# Altium schematic sheet 01 - NEW.SchDoc
size 513 x 386 mm
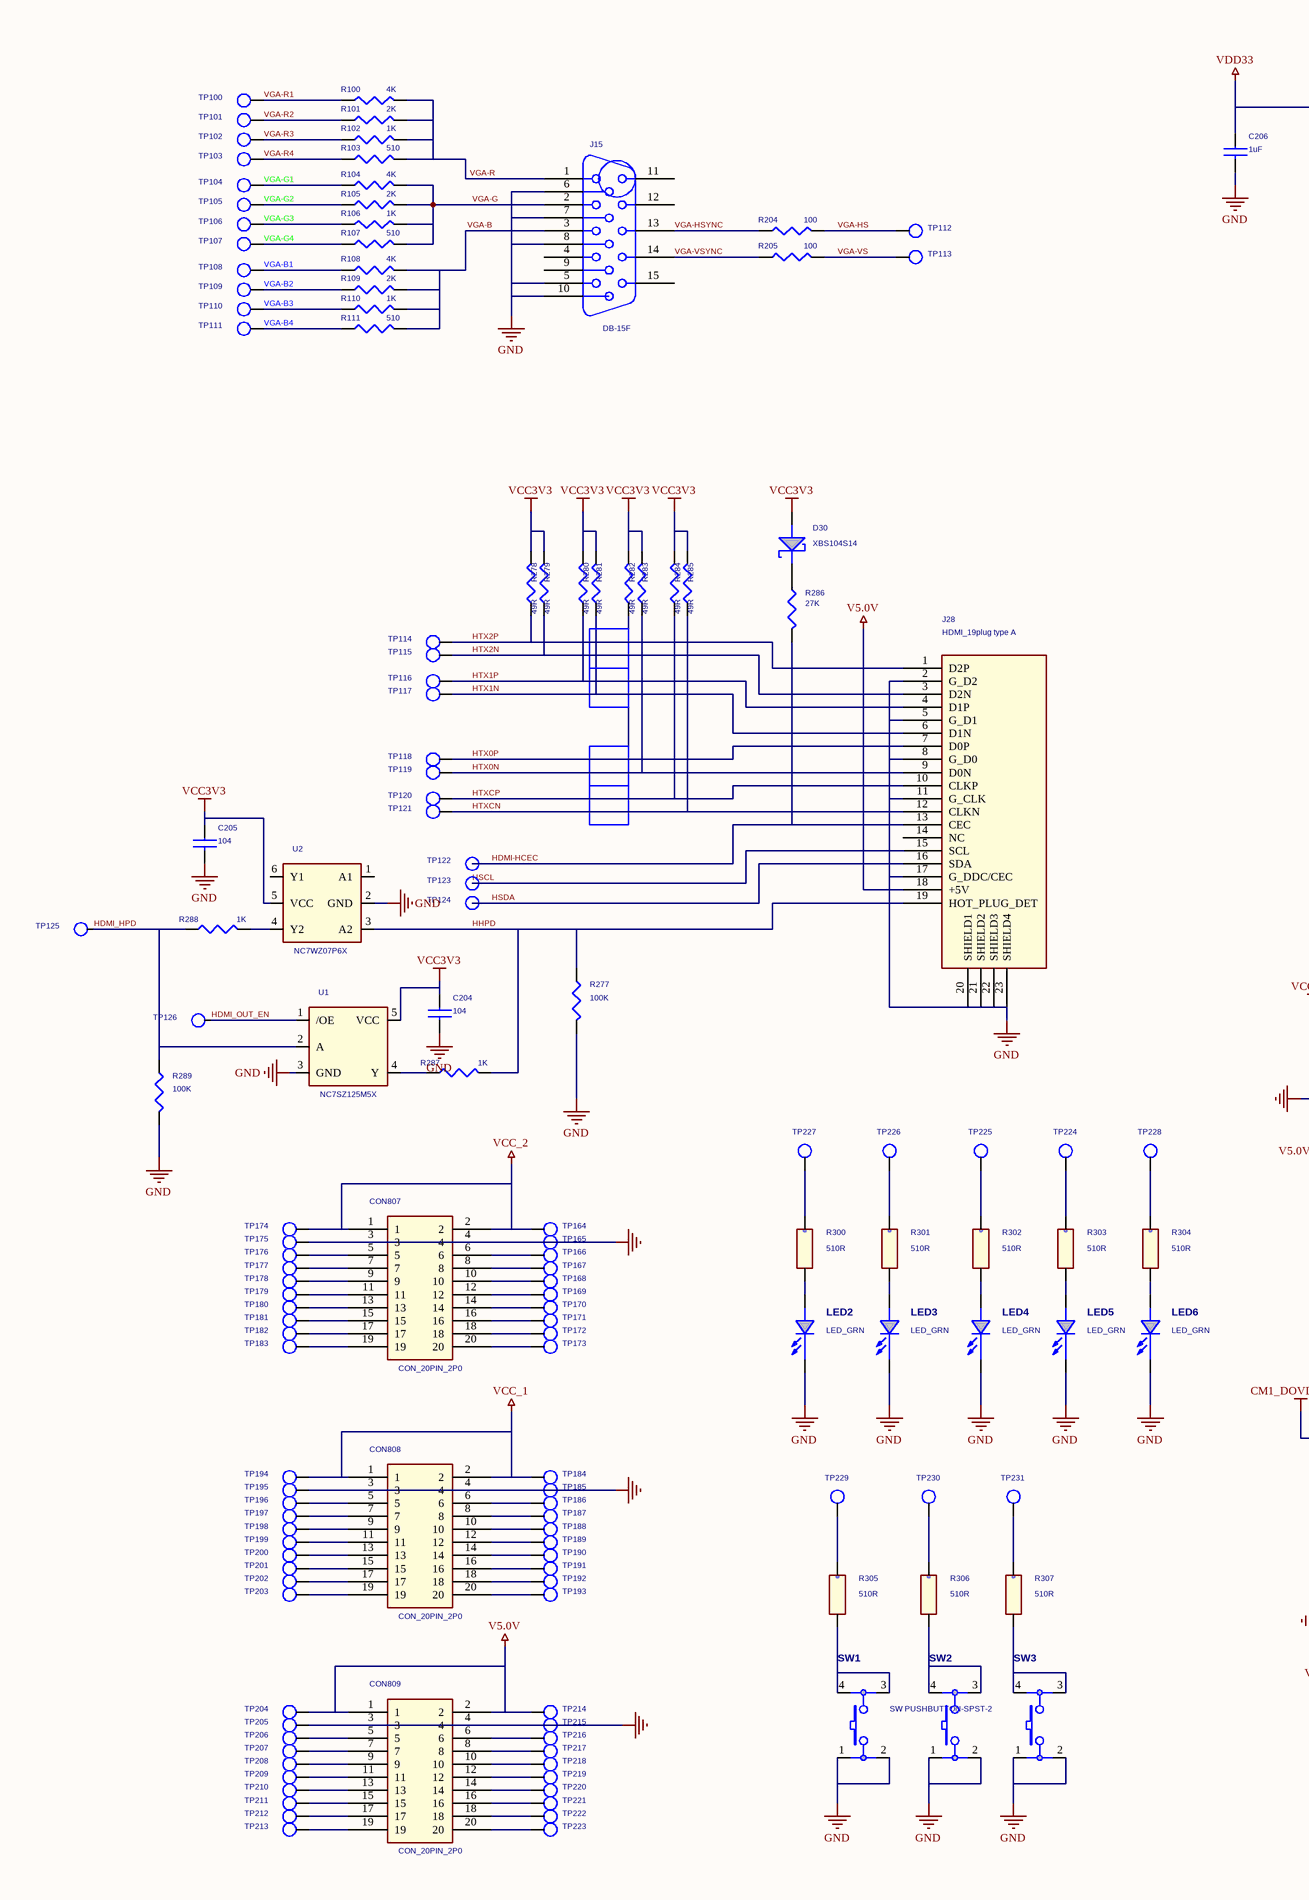
[diagram p0: 01 - NEW.SchDoc, left]
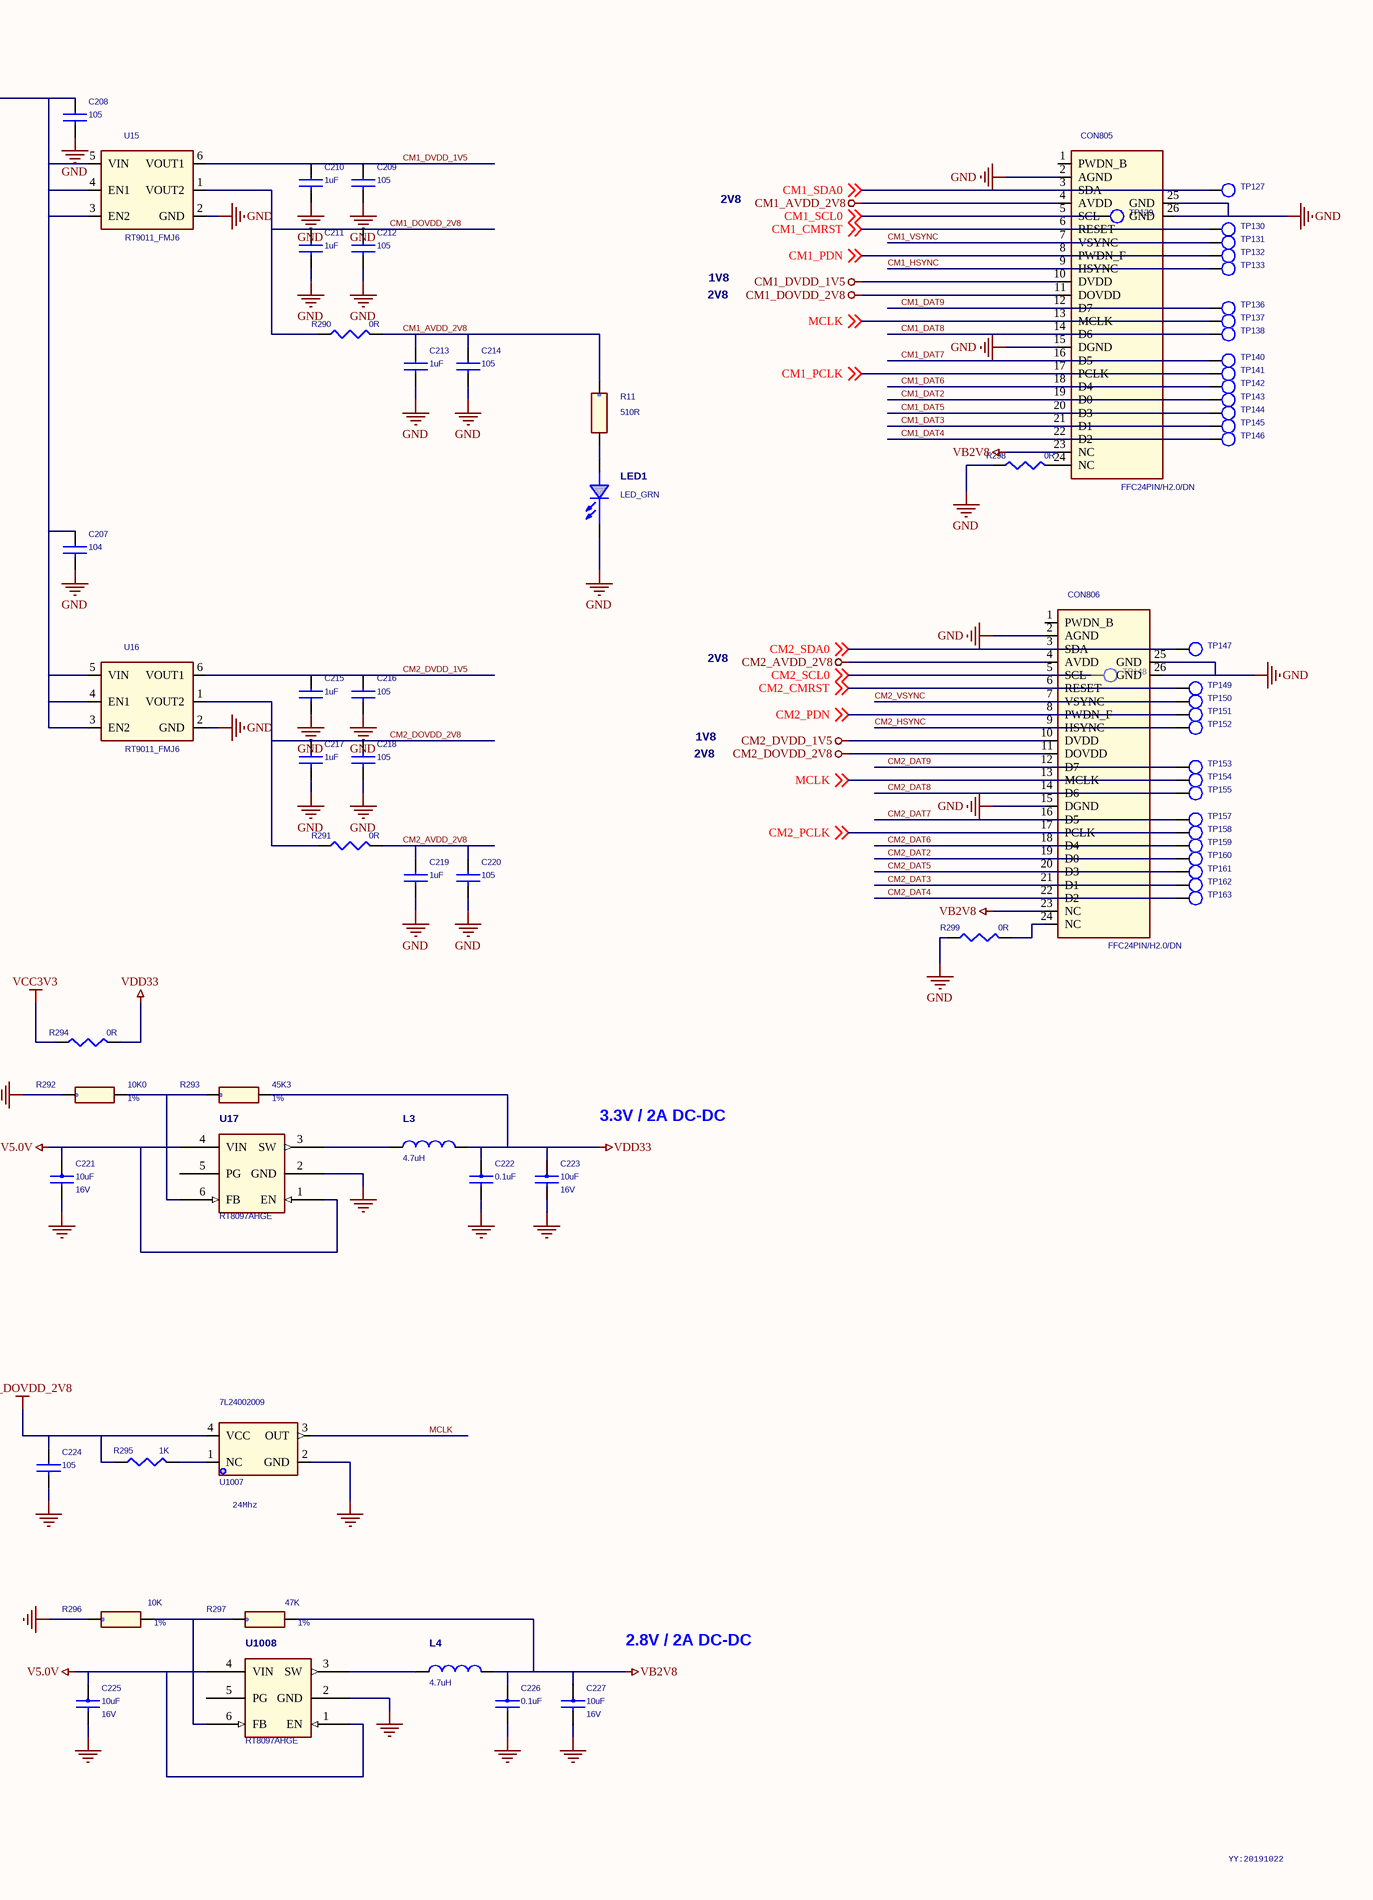
[diagram p1: 01 - NEW.SchDoc, right]

## Parts
C204  104  [C0603]
C205  104  [C0603]
C206  1uF  [C0603]
C207  104  [C0603]
C208  105  [C0603]
C209  105  [C0603]
C210  1uF  [C0603]
C211  1uF  [C0603]
C212  105  [C0603]
C213  1uF  [C0603]
C214  105  [C0603]
C215  1uF  [C0603]
C216  105  [C0603]
C217  1uF  [C0603]
C218  105  [C0603]
C219  1uF  [C0603]
C220  105  [C0603]
C221  10uF  Voltage: 16V  [CAP0603]
C222  0.1uF  [CAP0402]
C223  10uF  Voltage: 16V  [CAP0603]
C224  105  [C0603]
C225  10uF  Voltage: 16V  [CAP0603]
C226  0.1uF  [CAP0402]
C227  10uF  Voltage: 16V  [CAP0603]
CON805  FFC24PIN/H2.0/DN  [Molex52745-2090/P0.5]
CON806  FFC24PIN/H2.0/DN  [Molex52745-2090/P0.5]
CON807  CON_20PIN_2P0  [CON_20PIN_2P0]
CON808  CON_20PIN_2P0  [CON_20PIN_2P0]
CON809  CON_20PIN_2P0  [CON_20PIN_2P0]
D30  XBS104S14  [SOD123]
J15  DB-15F  [DB-9F]
J28  HDMI_19plug type A  [HDMI]
L3  4.7uH  [IND2520]
L4  4.7uH  [IND2520]
LED1  LED_GRN  [LED0402]
LED2  LED_GRN  [LED0402]
LED3  LED_GRN  [LED0402]
LED4  LED_GRN  [LED0402]
LED5  LED_GRN  [LED0402]
LED6  LED_GRN  [LED0402]
R11  510R  [RES0402]
R100  4K  [RES0402]
R101  2K  [RES0402]
R102  1K  [RES0402]
R103  510  [RES0402]
R104  4K  [RES0402]
R105  2K  [RES0402]
R106  1K  [RES0402]
R107  510  [RES0402]
R108  4K  [RES0402]
R109  2K  [RES0402]
R110  1K  [RES0402]
R111  510  [RES0402]
R204  100  [RES0402]
R205  100  [RES0402]
R277  100K  [RES0402]
R278  49R  [RES0402]
R279  49R  [RES0402]
R280  49R  [RES0402]
R281  49R  [RES0402]
R282  49R  [RES0402]
R283  49R  [RES0402]
R284  49R  [RES0402]
R285  49R  [RES0402]
R286  27K  [RES0402]
R287  1K  [RES0402]
R288  1K  [RES0402]
R289  100K  [RES0402]
R290  0R  [RES0402]
R291  0R  [RES0402]
R292  10K0  Tolerance: 1%  [RES0402]
R293  45K3  Tolerance: 1%  [RES0402]
R294  0R  [RES0402]
R295  1K  [RES0402]
R296  10K  Tolerance: 1%  [RES0402]
R297  47K  Tolerance: 1%  [RES0402]
R298  0R  [RES0402]
R299  0R  [RES0402]
R300  510R  [RES0402]
R301  510R  [RES0402]
R302  510R  [RES0402]
R303  510R  [RES0402]
R304  510R  [RES0402]
R305  510R  [RES0402]
R306  510R  [RES0402]
R307  510R  [RES0402]
SW1  SW PUSHBUTTON-SPST-2  [SW_TACT_4PIN]
SW2  SW PUSHBUTTON-SPST-2  [SW_TACT_4PIN]  (value not drawn)
SW3  SW PUSHBUTTON-SPST-2  [SW_TACT_4PIN]  (value not drawn)
TP100  T  [T60_40]  (value not drawn)
TP101  T  [T60_40]  (value not drawn)
TP102  T  [T60_40]  (value not drawn)
TP103  T  [T60_40]  (value not drawn)
TP104  T  [T60_40]  (value not drawn)
TP105  T  [T60_40]  (value not drawn)
TP106  T  [T60_40]  (value not drawn)
TP107  T  [T60_40]  (value not drawn)
TP108  T  [T60_40]  (value not drawn)
TP109  T  [T60_40]  (value not drawn)
TP110  T  [T60_40]  (value not drawn)
TP111  T  [T60_40]  (value not drawn)
TP112  T  [T60_40]  (value not drawn)
TP113  T  [T60_40]  (value not drawn)
TP114  T  [T60_40]  (value not drawn)
TP115  T  [T60_40]  (value not drawn)
TP116  T  [T60_40]  (value not drawn)
TP117  T  [T60_40]  (value not drawn)
TP118  T  [T60_40]  (value not drawn)
TP119  T  [T60_40]  (value not drawn)
TP120  T  [T60_40]  (value not drawn)
TP121  T  [T60_40]  (value not drawn)
TP122  T  [T60_40]  (value not drawn)
TP123  T  [T60_40]  (value not drawn)
TP124  T  [T60_40]  (value not drawn)
TP125  T  [T60_40]  (value not drawn)
TP126  T  [T60_40]  (value not drawn)
TP127  T  [T60_40]  (value not drawn)
TP129  T  [T60_40]  (value not drawn)
TP130  T  [T60_40]  (value not drawn)
TP131  T  [T60_40]  (value not drawn)
TP132  T  [T60_40]  (value not drawn)
TP133  T  [T60_40]  (value not drawn)
TP136  T  [T60_40]  (value not drawn)
TP137  T  [T60_40]  (value not drawn)
TP138  T  [T60_40]  (value not drawn)
TP140  T  [T60_40]  (value not drawn)
TP141  T  [T60_40]  (value not drawn)
TP142  T  [T60_40]  (value not drawn)
TP143  T  [T60_40]  (value not drawn)
TP144  T  [T60_40]  (value not drawn)
TP145  T  [T60_40]  (value not drawn)
TP146  T  [T60_40]  (value not drawn)
TP147  T  [T60_40]  (value not drawn)
TP148  T  [T60_40]  (value not drawn)
TP149  T  [T60_40]  (value not drawn)
TP150  T  [T60_40]  (value not drawn)
TP151  T  [T60_40]  (value not drawn)
TP152  T  [T60_40]  (value not drawn)
TP153  T  [T60_40]  (value not drawn)
TP154  T  [T60_40]  (value not drawn)
TP155  T  [T60_40]  (value not drawn)
TP157  T  [T60_40]  (value not drawn)
TP158  T  [T60_40]  (value not drawn)
TP159  T  [T60_40]  (value not drawn)
TP160  T  [T60_40]  (value not drawn)
TP161  T  [T60_40]  (value not drawn)
TP162  T  [T60_40]  (value not drawn)
TP163  T  [T60_40]  (value not drawn)
TP164  T  [T60_40]  (value not drawn)
TP165  T  [T60_40]  (value not drawn)
TP166  T  [T60_40]  (value not drawn)
TP167  T  [T60_40]  (value not drawn)
TP168  T  [T60_40]  (value not drawn)
TP169  T  [T60_40]  (value not drawn)
TP170  T  [T60_40]  (value not drawn)
TP171  T  [T60_40]  (value not drawn)
TP172  T  [T60_40]  (value not drawn)
TP173  T  [T60_40]  (value not drawn)
TP174  T  [T60_40]  (value not drawn)
TP175  T  [T60_40]  (value not drawn)
TP176  T  [T60_40]  (value not drawn)
TP177  T  [T60_40]  (value not drawn)
TP178  T  [T60_40]  (value not drawn)
TP179  T  [T60_40]  (value not drawn)
TP180  T  [T60_40]  (value not drawn)
TP181  T  [T60_40]  (value not drawn)
TP182  T  [T60_40]  (value not drawn)
TP183  T  [T60_40]  (value not drawn)
TP184  T  [T60_40]  (value not drawn)
TP185  T  [T60_40]  (value not drawn)
TP186  T  [T60_40]  (value not drawn)
TP187  T  [T60_40]  (value not drawn)
TP188  T  [T60_40]  (value not drawn)
TP189  T  [T60_40]  (value not drawn)
TP190  T  [T60_40]  (value not drawn)
TP191  T  [T60_40]  (value not drawn)
TP192  T  [T60_40]  (value not drawn)
TP193  T  [T60_40]  (value not drawn)
TP194  T  [T60_40]  (value not drawn)
TP195  T  [T60_40]  (value not drawn)
TP196  T  [T60_40]  (value not drawn)
TP197  T  [T60_40]  (value not drawn)
TP198  T  [T60_40]  (value not drawn)
TP199  T  [T60_40]  (value not drawn)
TP200  T  [T60_40]  (value not drawn)
TP201  T  [T60_40]  (value not drawn)
TP202  T  [T60_40]  (value not drawn)
TP203  T  [T60_40]  (value not drawn)
TP204  T  [T60_40]  (value not drawn)
TP205  T  [T60_40]  (value not drawn)
TP206  T  [T60_40]  (value not drawn)
TP207  T  [T60_40]  (value not drawn)
TP208  T  [T60_40]  (value not drawn)
TP209  T  [T60_40]  (value not drawn)
TP210  T  [T60_40]  (value not drawn)
TP211  T  [T60_40]  (value not drawn)
TP212  T  [T60_40]  (value not drawn)
TP213  T  [T60_40]  (value not drawn)
TP214  T  [T60_40]  (value not drawn)
TP215  T  [T60_40]  (value not drawn)
TP216  T  [T60_40]  (value not drawn)
TP217  T  [T60_40]  (value not drawn)
TP218  T  [T60_40]  (value not drawn)
TP219  T  [T60_40]  (value not drawn)
TP220  T  [T60_40]  (value not drawn)
TP221  T  [T60_40]  (value not drawn)
TP222  T  [T60_40]  (value not drawn)
TP223  T  [T60_40]  (value not drawn)
TP224  T  [T60_40]  (value not drawn)
TP225  T  [T60_40]  (value not drawn)
TP226  T  [T60_40]  (value not drawn)
TP227  T  [T60_40]  (value not drawn)
TP228  T  [T60_40]  (value not drawn)
TP229  T  [T60_40]  (value not drawn)
TP230  T  [T60_40]  (value not drawn)
TP231  T  [T60_40]  (value not drawn)
U1  NC7SZ125M5X  [NC7SZ125M5X]
U2  NC7WZ07P6X  [NC7WZ07P6X]
U15  RT9011_FMJ6  [RT9011_FMJ6]
U16  RT9011_FMJ6  [RT9011_FMJ6]
U17  RT8097AHGE  [SOT23-5]
U1007  7L24002009  [OSC/SMD/D1.3X2.1]
U1008  RT8097AHGE  [SOT23-5]

## Nets
CM1_AVDD_2V8: C213.1 C214.1 CON805.4(AVDD) R11.1 R290.2
CM1_DOVDD_2V8: C211.1 C212.1 C224.1 CON805.11(DOVDD) R290.1 R295.1 U15.1(VOUT2) U1007.4(VCC)
CM1_DVDD_1V5: C209.1 C210.1 CON805.10(DVDD) U15.6(VOUT1)
CM2_AVDD_2V8: C219.1 C220.1 CON806.4(AVDD) R291.2
CM2_DOVDD_2V8: C217.1 C218.1 CON806.11(DOVDD) R291.1 U16.1(VOUT2)
CM2_DVDD_1V5: C215.1 C216.1 CON806.10(DVDD) U16.6(VOUT1)
GND: C204.2 C205.2 C206.2 C207.2 C208.2 C209.2 C210.2 C211.2 C212.2 C213.2 C214.2 C215.2 C216.2 C217.2 C218.2 C219.2 C220.2 C221.2 C222.2 C223.2 C224.2 C225.2 C226.2 C227.2 CON805.2(AGND) CON805.15(DGND) CON805.25(GND) CON805.26(GND) CON806.2(AGND) CON806.15(DGND) CON806.25(GND) CON806.26(GND) CON807.3 CON807.4 CON808.3 CON808.4 CON809.3 CON809.4 J15.5 J15.6 J15.7 J15.8 J15.10 J28.2(G_D2) J28.5(G_D1) J28.8(G_D0) J28.11(G_CLK) J28.17(G_DDC/CEC) J28.20(SHIELD1) J28.21(SHIELD2) J28.22(SHIELD3) J28.23(SHIELD4) LED1.2(CATHODE) LED2.2(CATHODE) LED3.2(CATHODE) LED4.2(CATHODE) LED5.2(CATHODE) LED6.2(CATHODE) R277.2 R289.2 R292.1 R296.1 R298.1 R299.1 SW1.1 SW1.2 SW2.1 SW2.2 SW3.1 SW3.2 TP165.1(TP) TP175.1(TP) TP185.1(TP) TP195.1(TP) TP205.1(TP) TP215.1(TP) U1.3(GND) U2.2(GND) U15.2(GND) U16.2(GND) U17.2(GND) U1007.2(GND) U1008.2(GND)
V5.0V: C221.1 C225.1 CON809.1 CON809.2 J28.18(+5V) TP204.1(TP) TP214.1(TP) U17.1(EN) U17.4(VIN) U1008.1(EN) U1008.4(VIN)
VB2V8: C226.1 C227.1 CON805.23(NC) CON806.23(NC) L4.2 R297.2
VCC3V3: C204.1 C205.1 D30.1(A) R278.2 R279.2 R280.2 R281.2 R282.2 R283.2 R284.2 R285.2 R294.1 U1.5(VCC) U2.5(VCC)
VCC_1: CON808.1 CON808.2 TP184.1(TP) TP194.1(TP)
VCC_2: CON807.1 CON807.2 TP164.1(TP) TP174.1(TP)
VDD33: C206.1 C207.1 C208.1 C222.1 C223.1 L3.2 R293.2 R294.2 U15.3(EN2) U15.4(EN1) U15.5(VIN) U16.3(EN2) U16.4(EN1) U16.5(VIN)
CM1_CMRST: CON805.6(RESET) TP130.1(TP) ; off-sheet CM1_CMRST
CM1_DAT2: CON805.19(D0) TP143.1(TP)
CM1_DAT3: CON805.21(D1) TP145.1(TP)
CM1_DAT4: CON805.22(D2) TP146.1(TP)
CM1_DAT5: CON805.20(D3) TP144.1(TP)
CM1_DAT6: CON805.18(D4) TP142.1(TP)
CM1_DAT7: CON805.16(D5) TP140.1(TP)
CM1_DAT8: CON805.14(D6) TP138.1(TP)
CM1_DAT9: CON805.12(D7) TP136.1(TP)
CM1_HSYNC: CON805.9(HSYNC) TP133.1(TP)
CM1_PCLK: CON805.17(PCLK) TP141.1(TP) ; off-sheet CM1_PCLK
CM1_PDN: CON805.8(PWDN_F) TP132.1(TP) ; off-sheet CM1_PDN
CM1_SCL0: CON805.5(SCL) TP129.1(TP) ; off-sheet CM1_SCL0
CM1_SDA0: CON805.3(SDA) TP127.1(TP) ; off-sheet CM1_SDA0
CM1_VSYNC: CON805.7(VSYNC) TP131.1(TP)
CM2_CMRST: CON806.6(RESET) TP149.1(TP) ; off-sheet CM2_CMRST
CM2_DAT2: CON806.19(D0) TP160.1(TP)
CM2_DAT3: CON806.21(D1) TP162.1(TP)
CM2_DAT4: CON806.22(D2) TP163.1(TP)
CM2_DAT5: CON806.20(D3) TP161.1(TP)
CM2_DAT6: CON806.18(D4) TP159.1(TP)
CM2_DAT7: CON806.16(D5) TP157.1(TP)
CM2_DAT8: CON806.14(D6) TP155.1(TP)
CM2_DAT9: CON806.12(D7) TP153.1(TP)
CM2_HSYNC: CON806.9(HSYNC) TP152.1(TP)
CM2_PCLK: CON806.17(PCLK) TP158.1(TP) ; off-sheet CM2_PCLK
CM2_PDN: CON806.8(PWDN_F) TP151.1(TP) ; off-sheet CM2_PDN
CM2_SCL0: CON806.5(SCL) TP148.1(TP) ; off-sheet CM2_SCL0
CM2_SDA0: CON806.3(SDA) TP147.1(TP) ; off-sheet CM2_SDA0
CM2_VSYNC: CON806.7(VSYNC) TP150.1(TP)
HDMI-HCEC: J28.13(CEC) R286.1 TP122.1(TP)
HDMI_HPD: R288.1 R289.1 TP125.1(TP) U1.2(A)
HDMI_OUT_EN: TP126.1(TP) U1.1(/OE)
HHPD: J28.19(HOT_PLUG_DET) R277.1 R287.2 U2.3(A2)
HSCL: J28.15(SCL) TP123.1(TP)
HSDA: J28.16(SDA) TP124.1(TP)
HTX0N: J28.9(D0N) R283.1 TP119.1(TP)
HTX0P: J28.7(D0P) R282.1 TP118.1(TP)
HTX1N: J28.6(D1N) R281.1 TP117.1(TP)
HTX1P: J28.4(D1P) R280.1 TP116.1(TP)
HTX2N: J28.3(D2N) R279.1 TP115.1(TP)
HTX2P: J28.1(D2P) R278.1 TP114.1(TP)
HTXCN: J28.12(CLKN) R285.1 TP121.1(TP)
HTXCP: J28.10(CLKP) R284.1 TP120.1(TP)
MCLK: CON805.13(MCLK) CON806.13(MCLK) TP137.1(TP) TP154.1(TP) U1007.3(OUT) ; off-sheet MCLK
VGA-B: J15.3 R108.2 R109.2 R110.2 R111.2
VGA-B1: R108.1 TP108.1(TP)
VGA-B2: R109.1 TP109.1(TP)
VGA-B3: R110.1 TP110.1(TP)
VGA-B4: R111.1 TP111.1(TP)
VGA-G: J15.2 R104.2 R105.2 R106.2 R107.2
VGA-G1: R104.1 TP104.1(TP)
VGA-G2: R105.1 TP105.1(TP)
VGA-G3: R106.1 TP106.1(TP)
VGA-G4: R107.1 TP107.1(TP)
VGA-HS: R204.2 TP112.1(TP)
VGA-HSYNC: J15.13 R204.1
VGA-R: J15.1 R100.2 R101.2 R102.2 R103.2
VGA-R1: R100.1 TP100.1(TP)
VGA-R2: R101.1 TP101.1(TP)
VGA-R3: R102.1 TP102.1(TP)
VGA-R4: R103.1 TP103.1(TP)
VGA-VS: R205.2 TP113.1(TP)
VGA-VSYNC: J15.14 R205.1
NetCON805_24: CON805.24(NC) R298.2
NetCON806_24: CON806.24(NC) R299.2
NetCON807_5: CON807.5 TP176.1(TP)
NetCON807_6: CON807.6 TP166.1(TP)
NetCON807_7: CON807.7 TP177.1(TP)
NetCON807_8: CON807.8 TP167.1(TP)
NetCON807_9: CON807.9 TP178.1(TP)
NetCON807_10: CON807.10 TP168.1(TP)
NetCON807_11: CON807.11 TP179.1(TP)
NetCON807_12: CON807.12 TP169.1(TP)
NetCON807_13: CON807.13 TP180.1(TP)
NetCON807_14: CON807.14 TP170.1(TP)
NetCON807_15: CON807.15 TP181.1(TP)
NetCON807_16: CON807.16 TP171.1(TP)
NetCON807_17: CON807.17 TP182.1(TP)
NetCON807_18: CON807.18 TP172.1(TP)
NetCON807_19: CON807.19 TP183.1(TP)
NetCON807_20: CON807.20 TP173.1(TP)
NetCON808_5: CON808.5 TP196.1(TP)
NetCON808_6: CON808.6 TP186.1(TP)
NetCON808_7: CON808.7 TP197.1(TP)
NetCON808_8: CON808.8 TP187.1(TP)
NetCON808_9: CON808.9 TP198.1(TP)
NetCON808_10: CON808.10 TP188.1(TP)
NetCON808_11: CON808.11 TP199.1(TP)
NetCON808_12: CON808.12 TP189.1(TP)
NetCON808_13: CON808.13 TP200.1(TP)
NetCON808_14: CON808.14 TP190.1(TP)
NetCON808_15: CON808.15 TP201.1(TP)
NetCON808_16: CON808.16 TP191.1(TP)
NetCON808_17: CON808.17 TP202.1(TP)
NetCON808_18: CON808.18 TP192.1(TP)
NetCON808_19: CON808.19 TP203.1(TP)
NetCON808_20: CON808.20 TP193.1(TP)
NetCON809_5: CON809.5 TP206.1(TP)
NetCON809_6: CON809.6 TP216.1(TP)
NetCON809_7: CON809.7 TP207.1(TP)
NetCON809_8: CON809.8 TP217.1(TP)
NetCON809_9: CON809.9 TP208.1(TP)
NetCON809_10: CON809.10 TP218.1(TP)
NetCON809_11: CON809.11 TP209.1(TP)
NetCON809_12: CON809.12 TP219.1(TP)
NetCON809_13: CON809.13 TP210.1(TP)
NetCON809_14: CON809.14 TP220.1(TP)
NetCON809_15: CON809.15 TP211.1(TP)
NetCON809_16: CON809.16 TP221.1(TP)
NetCON809_17: CON809.17 TP212.1(TP)
NetCON809_18: CON809.18 TP222.1(TP)
NetCON809_19: CON809.19 TP213.1(TP)
NetCON809_20: CON809.20 TP223.1(TP)
NetD30_2: D30.2(C) R286.2
NetL3_1: L3.1 U17.3(SW)
NetL4_1: L4.1 U1008.3(SW)
NetLED1_1: LED1.1(ANODE) R11.2
NetLED2_1: LED2.1(ANODE) R300.2
NetLED3_1: LED3.1(ANODE) R301.2
NetLED4_1: LED4.1(ANODE) R302.2
NetLED5_1: LED5.1(ANODE) R303.2
NetLED6_1: LED6.1(ANODE) R304.2
NetR287_1: R287.1 U1.4(Y)
NetR288_2: R288.2 U2.4(Y2)
NetR292_2: R292.2 R293.1 U17.6(FB)
NetR295_2: R295.2 U1007.1(NC)
NetR296_2: R296.2 R297.1 U1008.6(FB)
NetR300_1: R300.1 TP227.1(TP)
NetR301_1: R301.1 TP226.1(TP)
NetR302_1: R302.1 TP225.1(TP)
NetR303_1: R303.1 TP224.1(TP)
NetR304_1: R304.1 TP228.1(TP)
NetR305_1: R305.1 TP229.1(TP)
NetR305_2: R305.2 SW1.3 SW1.4
NetR306_1: R306.1 TP230.1(TP)
NetR306_2: R306.2 SW2.3 SW2.4
NetR307_1: R307.1 TP231.1(TP)
NetR307_2: R307.2 SW3.3 SW3.4

Not connected (* = marked no-connect by the designer): CON805 1(PWDN_B); CON806 1(PWDN_B); J15 4 9 11 12 15; J28 14(NC); U2 1(A1) 6(Y1); U17 5(PG); U1008 5(PG)

## Notes on the sheet
- 2V8
- 1V8
- 3.3V / 2A DC-DC
- (near U1007) 24Mhz
- 2.8V / 2A DC-DC
- YY:20191022

## Library data of the parts
C204-C220 C224 = C0603
C221 C223 C225 C227 = CAPACITOR NON-POL: Part Number: CCAP-00003-300; Tolerance: 20%
C222 = CAPACITOR NON-POL: Part Number: CCAP-00001-200; Tolerance: 10%; Voltage: 25V
C226 = CAPACITOR NON-POL: Part Number: CCAP-00001-200; Voltage: 25V; Tolerance: 10%
CON805 CON806 = FPC24_05: FFC24PIN,0.5mm间距,H=2.0mm 抽拉下接触; Part Number: 99201311000442; E/A: 主; ID: 9; Date: 2013-10-25; Distributor: ADM; Part Type: FFC座
D30 = DIODE_SCHOTTKY_3: ROOM: HDMIUSB
J15 = DB-15_1
J28 = HDMI19_PLUG: ROOM: HDMIUSB
L3 L4 = INDUCTOR: Part Number: CIND-00004-000; Tolerance: 10%
LED1-LED6 = LED: Part Number: CLED-00001-200
R11 R300-R307 = R_Dup1: Part Number: CRES-00023-200; Tolerance: 5%
R100-R111 R204 R205 R278-R285 R295 = RESISTOR_Dup1: ROOM: TVLCD
R277 R286 R289 = RESISTOR: ROOM: HDMIUSB
R287 R288 R290 R291 R294 R298 R299 = R: ROOM: HDMIUSB
R292 R296 = R_Dup1: Part Number: CRES-00006-200
R293 R297 = R_Dup1: Part Number: CRES-00021-200
SW1-SW3 = SW PUSHBUTTON-SPST-2: Part Number: CSWT-00001-000
TP100-TP127 TP129-TP133 TP136-TP138 TP140-TP155 TP157-TP231 = T_POINT_R: ROOM: POWER
U17 U1008 = DS8096AHGE: Part Number: CXIC-00014-000
U1007 = TCXO RAKON SMD 4P_3: TCXO-7L26002009,1.8V,0.5PPM,SMD,TXC; Part Number: 99200511470973; ID: 94; E/A: 主; Part Type: 贴片晶振; Distributor: 2494; Date: 2013-11-6